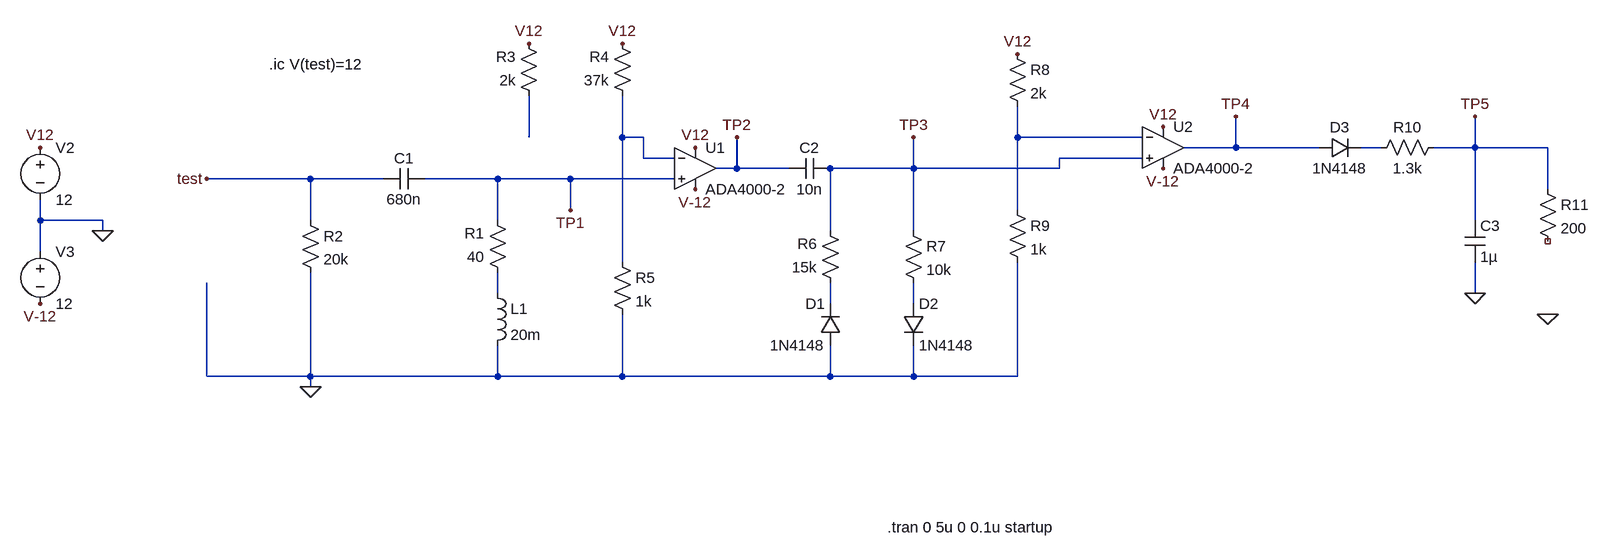
[diagram p0: schematic app6 I.asc]
app6 I.asc, the LTspice schematic file:
Version 4
SHEET 1 2420 680
WIRE 784 32 784 -32
WIRE 928 32 928 -32
WIRE 960 32 928 32
WIRE 1536 32 1536 -16
WIRE 1728 32 1536 32
WIRE 1872 48 1872 0
WIRE 1872 48 1792 48
WIRE 2000 48 1872 48
WIRE 2096 48 2064 48
WIRE 2240 48 2240 0
WIRE 2240 48 2176 48
WIRE 2352 48 2240 48
WIRE 960 64 960 32
WIRE 1008 64 960 64
WIRE 1728 64 1600 64
WIRE 1104 80 1104 32
WIRE 1104 80 1072 80
WIRE 1184 80 1104 80
WIRE 1376 80 1376 32
WIRE 1376 80 1248 80
WIRE 1600 80 1600 64
WIRE 1600 80 1376 80
WIRE 448 96 288 96
WIRE 560 96 448 96
WIRE 736 96 624 96
WIRE 848 96 736 96
WIRE 1008 96 848 96
WIRE 2352 112 2352 48
WIRE 848 144 848 96
WIRE 1536 144 1536 32
WIRE 32 160 32 128
WIRE 128 160 32 160
WIRE 448 160 448 96
WIRE 736 160 736 96
WIRE 2240 160 2240 48
WIRE 128 176 128 160
WIRE 1248 176 1248 80
WIRE 1376 176 1376 80
WIRE 32 208 32 160
WIRE 928 224 928 32
WIRE 736 272 736 240
WIRE 2240 272 2240 224
WIRE 1248 288 1248 256
WIRE 1376 288 1376 256
WIRE 288 400 288 256
WIRE 448 400 448 240
WIRE 448 400 288 400
WIRE 736 400 736 352
WIRE 736 400 448 400
WIRE 928 400 928 304
WIRE 928 400 736 400
WIRE 1248 400 1248 352
WIRE 1248 400 928 400
WIRE 1376 400 1376 352
WIRE 1376 400 1248 400
WIRE 1536 400 1536 224
WIRE 1536 400 1376 400
WIRE 448 416 448 400
FLAG 128 176 0
FLAG 32 48 V12
FLAG 32 288 V-12
FLAG 448 416 0
FLAG 848 144 TP1
FLAG 928 -112 V12
FLAG 784 -112 V12
FLAG 1104 32 TP2
FLAG 1536 -96 V12
FLAG 1376 32 TP3
FLAG 1872 0 TP4
FLAG 2240 272 0
FLAG 2352 304 0
FLAG 2240 0 TP5
FLAG 1040 112 V-12
FLAG 1760 80 V-12
FLAG 1040 48 V12
FLAG 1760 16 V12
FLAG 288 96 test
SYMBOL voltage 32 32 R0
WINDOW 123 0 0 Left 0
WINDOW 39 0 0 Left 0
SYMATTR InstName V2
SYMATTR Value 12
SYMBOL voltage 32 192 R0
WINDOW 123 0 0 Left 0
WINDOW 39 0 0 Left 0
SYMATTR InstName V3
SYMATTR Value 12
SYMBOL res 432 144 R0
SYMATTR InstName R2
SYMATTR Value 20k
SYMBOL cap 624 80 R90
WINDOW 0 0 32 VBottom 2
WINDOW 3 32 32 VTop 2
SYMATTR InstName C1
SYMATTR Value 680n
SYMBOL res 912 208 R0
SYMATTR InstName R5
SYMATTR Value 1k
SYMBOL res 944 -16 R180
WINDOW 0 36 76 Left 2
WINDOW 3 36 40 Left 2
SYMATTR InstName R4
SYMATTR Value 37k
SYMBOL res 800 -16 R180
WINDOW 0 36 76 Left 2
WINDOW 3 36 40 Left 2
SYMATTR InstName R3
SYMATTR Value 2k
SYMBOL cap 1248 64 R90
WINDOW 0 0 32 VBottom 2
WINDOW 3 32 32 VTop 2
SYMATTR InstName C2
SYMATTR Value 10n
SYMBOL res 1264 272 R180
WINDOW 0 36 76 Left 2
WINDOW 3 36 40 Left 2
SYMATTR InstName R6
SYMATTR Value 15k
SYMBOL res 1360 160 R0
SYMATTR InstName R7
SYMATTR Value 10k
SYMBOL diode 1264 352 R180
WINDOW 0 24 64 Left 2
WINDOW 3 24 0 Left 2
SYMATTR InstName D1
SYMATTR Value 1N4148
SYMBOL diode 1360 288 R0
SYMATTR InstName D2
SYMATTR Value 1N4148
SYMBOL res 1520 128 R0
SYMATTR InstName R9
SYMATTR Value 1k
SYMBOL res 1520 -112 R0
SYMATTR InstName R8
SYMATTR Value 2k
SYMBOL diode 2000 64 R270
WINDOW 0 32 32 VTop 2
WINDOW 3 0 32 VBottom 2
SYMATTR InstName D3
SYMATTR Value 1N4148
SYMBOL res 2192 32 R90
WINDOW 0 0 56 VBottom 2
WINDOW 3 32 56 VTop 2
SYMATTR InstName R10
SYMATTR Value 1.3k
SYMBOL cap 2224 160 R0
SYMATTR InstName C3
SYMATTR Value 1µ
SYMBOL res 2336 96 R0
SYMATTR InstName R11
SYMATTR Value 200
SYMBOL res 752 256 R180
WINDOW 0 36 76 Left 2
WINDOW 3 36 40 Left 2
SYMATTR InstName R1
SYMATTR Value 40
SYMBOL OpAmps\\ADA4000-2 1040 16 R0
SYMATTR InstName U1
SYMBOL OpAmps\\ADA4000-2 1760 -16 R0
SYMATTR InstName U2
SYMBOL ind 720 256 R0
SYMATTR InstName L1
SYMATTR Value 20m
TEXT 1336 632 Left 2 !.tran 0 5u 0 0.1u startup
TEXT 384 -80 Left 2 !.ic V(test)=12

The netlist it stands for:
* app6 I.asc
V2 V12 0 12
V3 0 V-12 12
R2 test 0 20k
C1 TP1 test 680n
R5 N002 0 1k
R4 N002 V12 37k
R3 N001 V12 2k
C2 TP3 TP2 10n
R6 N006 TP3 15k
R7 TP3 N007 10k
D1 0 N006 1N4148
D2 N007 0 1N4148
R9 N003 0 1k
R8 V12 N003 2k
D3 TP4 N004 1N4148
R10 TP5 N004 1.3k
C3 TP5 0 1µ
R11 TP5 NC_01 200
R1 N005 TP1 40
XU1 TP1 N002 V12 V-12 TP2 ADA4000-2  ; pins In+ In- V+ V- OUT
XU2 TP3 N003 V12 V-12 TP4 ADA4000-2  ; pins In+ In- V+ V- OUT
L1 N005 0 20m
.model D D
.lib standard.dio
.tran 0 5u 0 0.1u startup
.ic V(test)=12
.backanno
.end